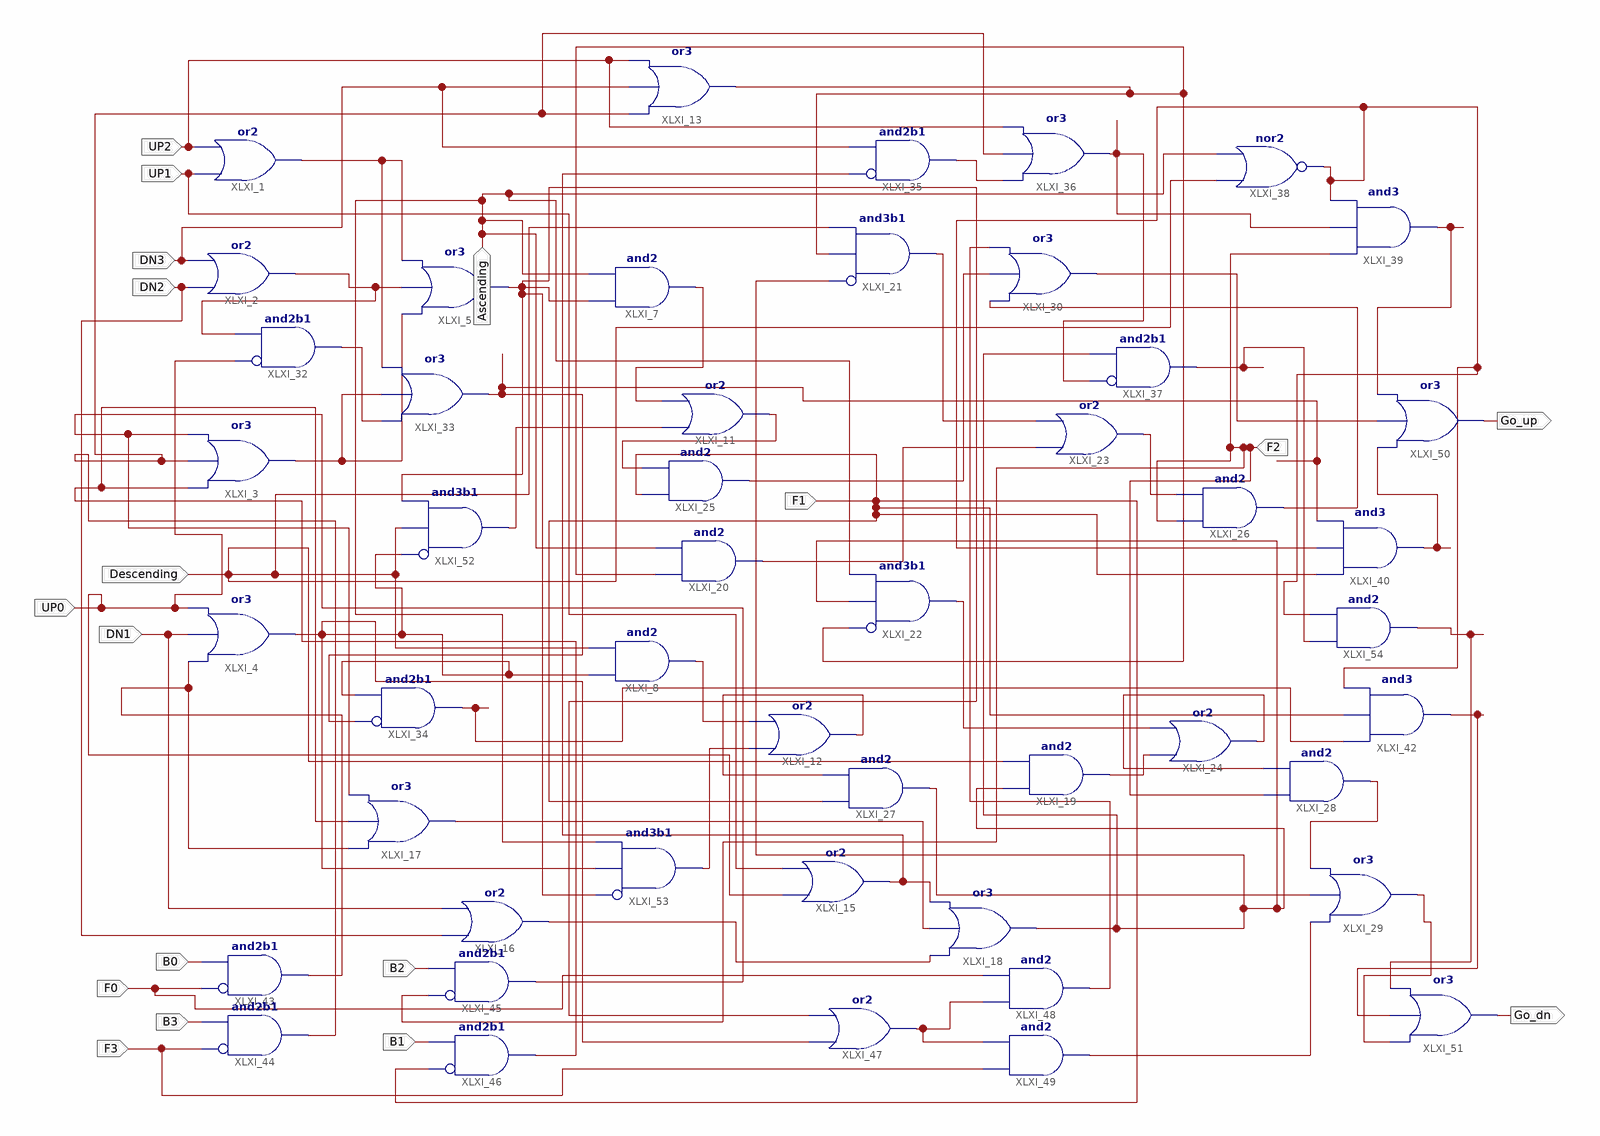
[diagram p0: schematic sheet 1]
// Xilinx ISE schematic Lab2.sch (spartan6) as structural Verilog: 48 symbols, 18 ports
module Lab2 (
  input  Descending,
  input  UP2,
  input  UP1,
  input  DN3,
  input  DN2,
  input  DN1,
  input  UP0,
  input  F1,
  input  F0,
  input  B0,
  input  B3,
  input  F3,
  input  B2,
  input  B1,
  input  F2,
  input  Ascending,
  output Go_up,
  output Go_dn
);

  wire B1_, B2_, B3_, F1_haltedd, F1_Haltedu, F1_sir, F1_sird, F2_haltedd, F2_haltedu, F2_sir, F2_sird,
       Go_dn_, Go_up_, XLXN_10, XLXN_13, XLXN_14, XLXN_15, XLXN_16, XLXN_35, XLXN_36, XLXN_43, XLXN_44,
       XLXN_45, XLXN_46, XLXN_47, XLXN_48, XLXN_49, XLXN_50, XLXN_51, XLXN_56, XLXN_58, XLXN_59, XLXN_111,
       XLXN_113, XLXN_114, XLXN_115, XLXN_117, XLXN_123, XLXN_124, XLXN_127, XLXN_137, XLXN_147, XLXN_160,
       XLXN_161, XLXN_162, XLXN_175;

  or XLXI_1 (XLXN_111, UP1, UP2);
  or XLXI_2 (XLXN_113, DN2, DN3);
  or XLXI_3 (XLXN_114, B1_, B3_, B2_);
  or XLXI_4 (XLXN_117, XLXN_147, DN1, UP0);
  or XLXI_5 (XLXN_10, XLXN_114, XLXN_113, XLXN_111);
  and XLXI_7 (XLXN_13, XLXN_10, Ascending);
  and XLXI_8 (XLXN_15, XLXN_117, Descending);
  or XLXI_11 (XLXN_48, XLXN_14, XLXN_13);
  or XLXI_12 (XLXN_51, XLXN_16, XLXN_15);
  or XLXI_13 (XLXN_43, B3_, DN3, UP2);
  or XLXI_15 (XLXN_123, UP0, UP1);
  or XLXI_16 (XLXN_36, DN2, DN1);
  or XLXI_17 (XLXN_35, XLXN_147, B1_, B2_);
  or XLXI_18 (XLXN_127, XLXN_36, XLXN_35, XLXN_123);
  and XLXI_19 (XLXN_46, XLXN_127, Descending);
  and XLXI_20 (XLXN_45, XLXN_43, Ascending);
  and XLXI_21 (XLXN_44, ~XLXN_127, XLXN_43, Descending);  // and3b1
  and XLXI_22 (XLXN_47, ~XLXN_43, XLXN_127, Ascending);  // and3b1
  or XLXI_23 (XLXN_49, XLXN_45, XLXN_44);
  or XLXI_24 (XLXN_50, XLXN_46, XLXN_47);
  and XLXI_25 (XLXN_175, F1, XLXN_48);
  and XLXI_26 (XLXN_56, F2, XLXN_49);
  and XLXI_27 (XLXN_59, F1, XLXN_51);
  and XLXI_28 (XLXN_58, F2, XLXN_50);
  or XLXI_29 (Go_dn_, XLXN_161, XLXN_59, XLXN_58);
  or XLXI_30 (Go_up_, XLXN_56, XLXN_175, XLXN_162);
  and XLXI_32 (XLXN_115, ~UP0, XLXN_113);  // and2b1
  or XLXI_33 (F1_sir, XLXN_115, XLXN_114, XLXN_111);
  and XLXI_34 (F1_sird, ~F1_sir, XLXN_117);  // and2b1
  and XLXI_35 (XLXN_124, ~XLXN_123, DN3);  // and2b1
  or XLXI_36 (F2_sir, XLXN_124, B3_, UP2);
  and XLXI_37 (F2_sird, ~F2_sir, XLXN_127);  // and2b1
  nor XLXI_38 (XLXN_137, Descending, Ascending);
  and XLXI_39 (F2_haltedu, F2, F2_sir, XLXN_137);
  and XLXI_40 (F1_Haltedu, F1, XLXN_137, F1_sir);
  and XLXI_42 (F1_haltedd, F1_sird, F1, XLXN_137);
  and XLXI_43 (XLXN_147, ~F0, B0);  // and2b1
  and XLXI_44 (B3_, ~F3, B3);  // and2b1
  and XLXI_45 (B2_, ~F2, B2);  // and2b1
  and XLXI_46 (B1_, ~F1, B1);  // and2b1
  or XLXI_47 (XLXN_160, XLXN_117, XLXN_10);
  and XLXI_48 (XLXN_162, XLXN_160, F0);
  and XLXI_49 (XLXN_161, F3, XLXN_160);
  or XLXI_50 (Go_up, F1_Haltedu, Go_up_, F2_haltedu);
  or XLXI_51 (Go_dn, Go_dn_, F1_haltedd, F2_haltedd);
  and XLXI_52 (XLXN_14, ~XLXN_117, Descending, XLXN_10);  // and3b1
  and XLXI_53 (XLXN_16, ~XLXN_10, XLXN_117, Ascending);  // and3b1
  and XLXI_54 (F2_haltedd, F2_sird, XLXN_137);
endmodule
